# EAGLE schematic july-10 (EAGLE 7.6.0)
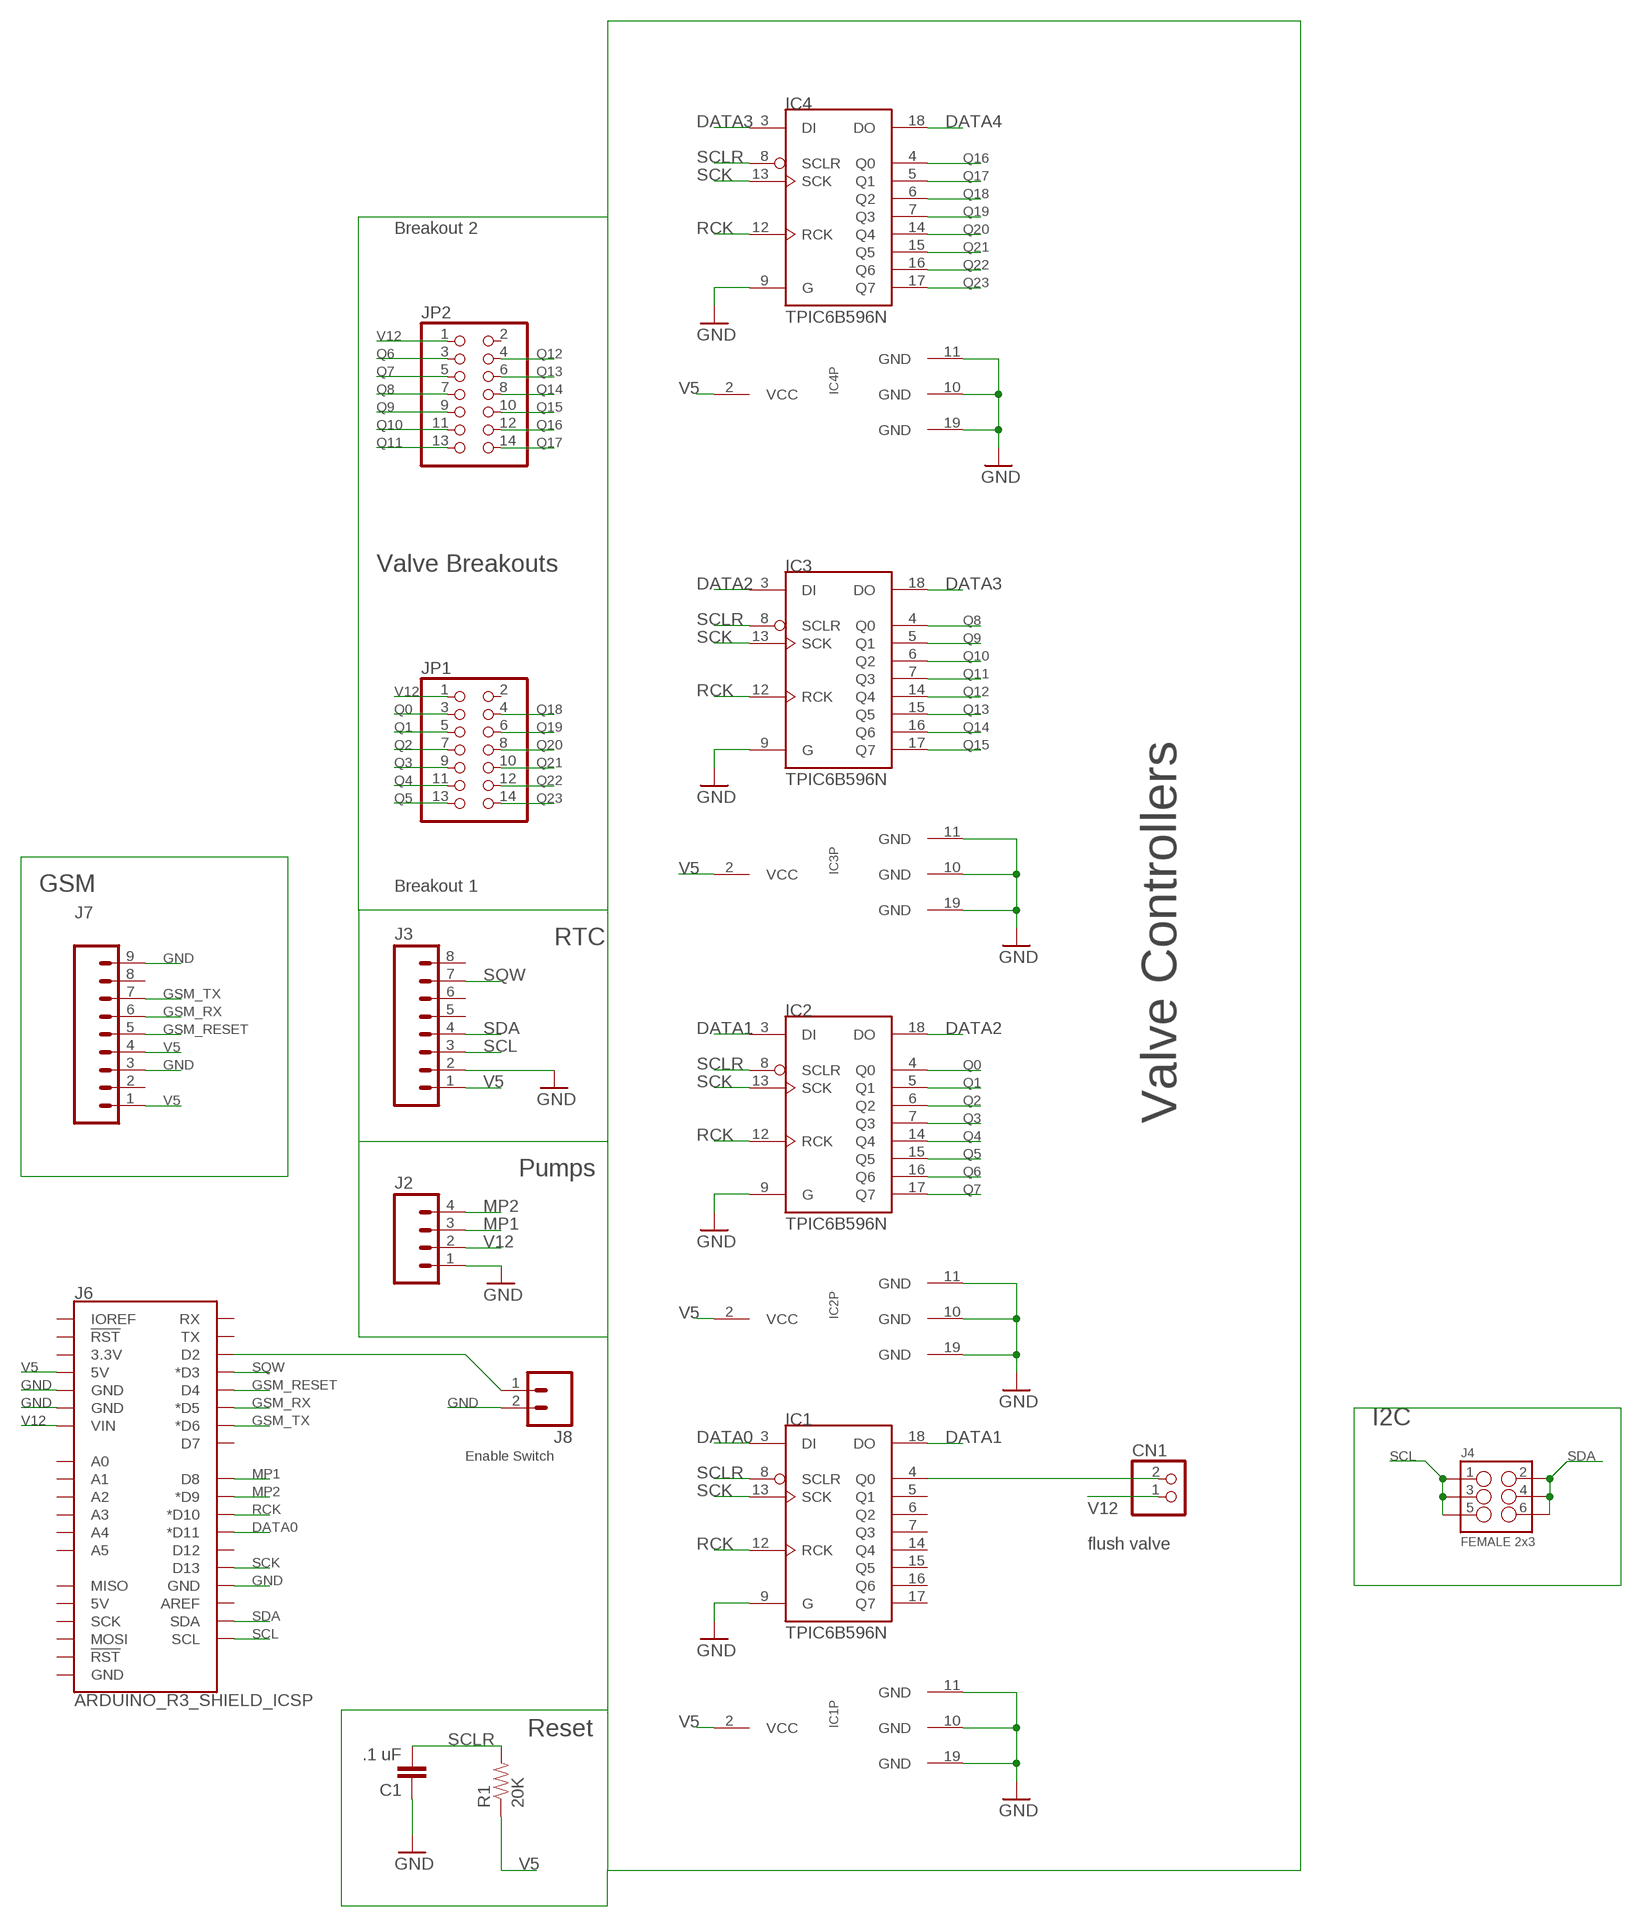
[diagram p0: schematic, sheet 1]

## Parts
C1  .1 uF  CAP_  [AXIAL-5MM]
CN1  JST_2PIN-THM  [JST-PH-2-THM]
IC1  TPIC6B596N  [DIL20]
IC2  TPIC6B596N  [DIL20]
IC3  TPIC6B596N  [DIL20]
IC4  TPIC6B596N  [DIL20]
J2  M04PTH  [1X04]
J3  M08  [1X08_ROUND]
J4  FEMALE 2x3  M03X2FEMALE  [2X3]
J6  ARDUINO_R3_SHIELD_ICSP  [UNO_R3_SHIELD_ICSP]
J7  M09  [1X09]
J8  M02PTH  [1X02]
JP1  PINHD-2X7  [2X07]
JP2  PINHD-2X7  [2X07]
R1  20K  RESISTORPTH-1/4W  [AXIAL-0.4]

## Nets
DATA0: IC1.3(DI) J6.D11(*D11)
DATA1: IC1.18(DO) IC2.3(DI)
DATA2: IC2.18(DO) IC3.3(DI)
DATA3: IC3.18(DO) IC4.3(DI)
DATA4: IC4.18(DO)
GND [GND]: C1.P$1 IC1.9(G) IC1.10(GND) IC1.11(GND) IC1.19(GND) IC2.9(G) IC2.10(GND) IC2.11(GND) IC2.19(GND) IC3.9(G) IC3.10(GND) IC3.11(GND) IC3.19(GND) IC4.9(G) IC4.10(GND) IC4.11(GND) IC4.19(GND) J2.1 J3.2 J6.GND@0(GND) J6.GND@1(GND) J6.GND@2(GND) J7.3 J7.9 J8.2
GSM_RESET: J6.D4 J7.5
GSM_RX: J6.D5(*D5) J7.6
GSM_TX: J6.D6(*D6) J7.7
MP1: J2.3 J6.D8
MP2: J2.4 J6.D9(*D9)
N$2 [VCC12]: CN1.2 IC1.4(Q0)
N$5: J6.D2 J8.1
Q0 [VCC12]: IC2.4(Q0) JP1.3
Q1 [VCC12]: IC2.5(Q1) JP1.5
Q2 [VCC12]: IC2.6(Q2) JP1.7
Q3 [VCC12]: IC2.7(Q3) JP1.9
Q4 [VCC12]: IC2.14(Q4) JP1.11
Q5 [VCC12]: IC2.15(Q5) JP1.13
Q6 [VCC12]: IC2.16(Q6) JP2.3
Q7 [VCC12]: IC2.17(Q7) JP2.5
Q8 [VCC12]: IC3.4(Q0) JP2.7
Q9 [VCC12]: IC3.5(Q1) JP2.9
Q10 [VCC12]: IC3.6(Q2) JP2.11
Q11 [VCC12]: IC3.7(Q3) JP2.13
Q12: IC3.14(Q4) JP2.4
Q13 [VCC12]: IC3.15(Q5) JP2.6
Q14 [VCC12]: IC3.16(Q6) JP2.8
Q15 [VCC12]: IC3.17(Q7) JP2.10
Q16 [VCC12]: IC4.4(Q0) JP2.12
Q17 [VCC12]: IC4.5(Q1) JP2.14
Q18 [VCC12]: IC4.6(Q2) JP1.4
Q19 [VCC12]: IC4.7(Q3) JP1.6
Q20 [VCC12]: IC4.14(Q4) JP1.8
Q21 [VCC12]: IC4.15(Q5) JP1.10
Q22 [VCC12]: IC4.16(Q6) JP1.12
Q23 [VCC12]: IC4.17(Q7) JP1.14
RCK: IC1.12(RCK) IC2.12(RCK) IC3.12(RCK) IC4.12(RCK) J6.D10(*D10)
SCK: IC1.13(SCK) IC2.13(SCK) IC3.13(SCK) IC4.13(SCK) J6.D13
SCL: J3.3 J4.1 J4.3 J4.5 J6.SCL
SCLR: C1.P$2 IC1.8(SCLR) IC2.8(SCLR) IC3.8(SCLR) IC4.8(SCLR) R1.P$2
SDA: J3.4 J4.2 J4.4 J4.6 J6.SDA
SQW: J3.7 J6.D3(*D3)
V5 [VCC5]: IC1.2(VCC) IC2.2(VCC) IC3.2(VCC) IC4.2(VCC) J3.1 J6.5V J7.1 J7.4 R1.P$1
V12 [VCC12]: CN1.1 J2.2 J6.VIN JP1.1 JP2.1
Unconnected: IC1.5(Q1) IC1.6(Q2) IC1.7(Q3) IC1.14(Q4) IC1.15(Q5) IC1.16(Q6) IC1.17(Q7) J3.5 J3.6 J3.8 J6.3.3V J6.5V_ICSP(5V) J6.A0 J6.A1 J6.A2 J6.A3 J6.A4 J6.A5 J6.AREF J6.D7 J6.D12 J6.GND_ICSP(GND) J6.IOREF J6.MISO J6.MOSI J6.RES(!RST!) J6.RST_ICSP(!RST!) J6.RX J6.SCK J6.TX J7.2 J7.8 JP1.2 JP2.2

## Notes on the sheet
- Breakout 2
- Valve Breakouts
- GSM | Breakout 1
- RTC
- Valve Controllers
- Pumps
- I2C
- Enable Switch
- flush valve
- Reset

## Library data of the parts
C1 = SparkFun-Capacitors:CAP: Capacitor Standard 0603 ceramic capacitor, and 0.1" leaded capacitor.
CN1 = adafruit:JST_2PIN: JST 2-Pin Connectors of various flavors SMT-RA (S2B-PH-SM4) 4UConnector #17311 SMT (B2B-PH-SM4) THM-RA (S2B-PH) THM (B2B-PH)
IC1-IC4 = tpic:TPIC6B596
J2 = SparkFun-Connectors:M04: Header 4 Standard 4-pin 0.1" header. Use with straight break away headers (SKU : PRT-00116), right angle break away headers (PRT-00553), swiss pins (PRT-00743), machine pins (PRT-00117), and female headers (PRT-00115). Molex polarized connector foot print use with SKU : PRT-08231 with associated crimp pins and housings. 1MM SMD Version SKU: PRT-10208; PROD_ID: CONN-09696
J3 = SparkFun-Connectors:M08: Header 8 Standard 8-pin 0.1" header. Use with straight break away headers (SKU : PRT-00116), right angle break away headers (PRT-00553), swiss pins (PRT-00743), machine pins (PRT-00117), and female headers (PRT-00115).; PROD_ID: CONN-08437
J4 = SparkFun-Connectors:M03X2: 2x3 .1" header. Shrouded, with keying- CONN-10681 SMT- CONN-11415 Pogo pins- HW-11044; PROD_ID: CONN-11566
J6 = SparkFun-Boards:ARDUINO_R3_SHIELD_ICSP: Arduino R3 Shield Footprint w/ 6-pin (2x3) ICSP Header
J7 = SparkFun-Connectors:M09: Header 9 Standard 9-pin 0.1" header. Use with straight break away headers (SKU : PRT-00116), right angle break away headers (PRT-00553), swiss pins (PRT-00743), machine pins (PRT-00117), and female headers (PRT-00115).
J8 = SparkFun-Connectors:M02: Standard 2-pin 0.1" header. Use with - straight break away headers ( PRT-00116) - right angle break away headers (PRT-00553) - swiss pins (PRT-00743) - machine pins (PRT-00117) - female headers (PRT-00115) Molex polarized connector foot print use with: PRT-08233 with associated crimp pins and housings. 2.54_SCREWTERM for use with PRT-10571. 3.5mm Screw Terminal footprints for PRT-08084 5mm Screw Terminal footprints for use with PRT-08432
JP1 JP2 = pinhead:PINHD-2X7: PIN HEADER
R1 = SparkFun-Passives:RESISTOR: Resistor Basic schematic elements and footprints for 0603, 1206, and PTH resistors.

## Net classes
0 default: width 0.406 mm
1 GND: width 0.61 mm
2 VCC12: width 0.61 mm
3 VCC5: width 0.508 mm